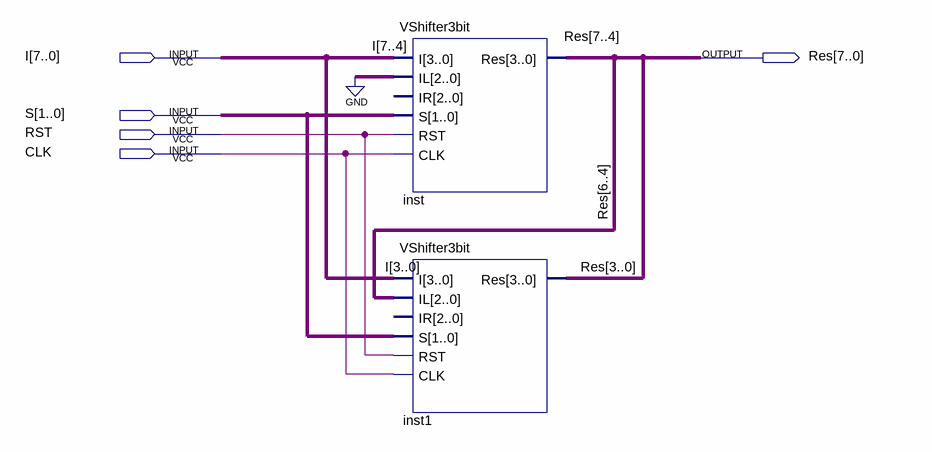
[diagram p0: schematic sheet]
// Quartus schematic 8VS3.bdf as structural Verilog: 2 symbols, 5 pins
module \8VS3  (
  input  [7:0] I,
  input  [1:0] S,
  input  RST,
  input  CLK,
  output [7:0] Res
);

  VShifter3bit inst (.I(I[7:4]), .IL(3'b000), .S(S), .RST(RST), .CLK(CLK), .Res(Res[7:4]));  // open: IR
  VShifter3bit inst1 (.I(I[3:0]), .IL(Res[6:4]), .S(S), .RST(RST), .CLK(CLK), .Res(Res[3:0]));  // open: IR
endmodule
